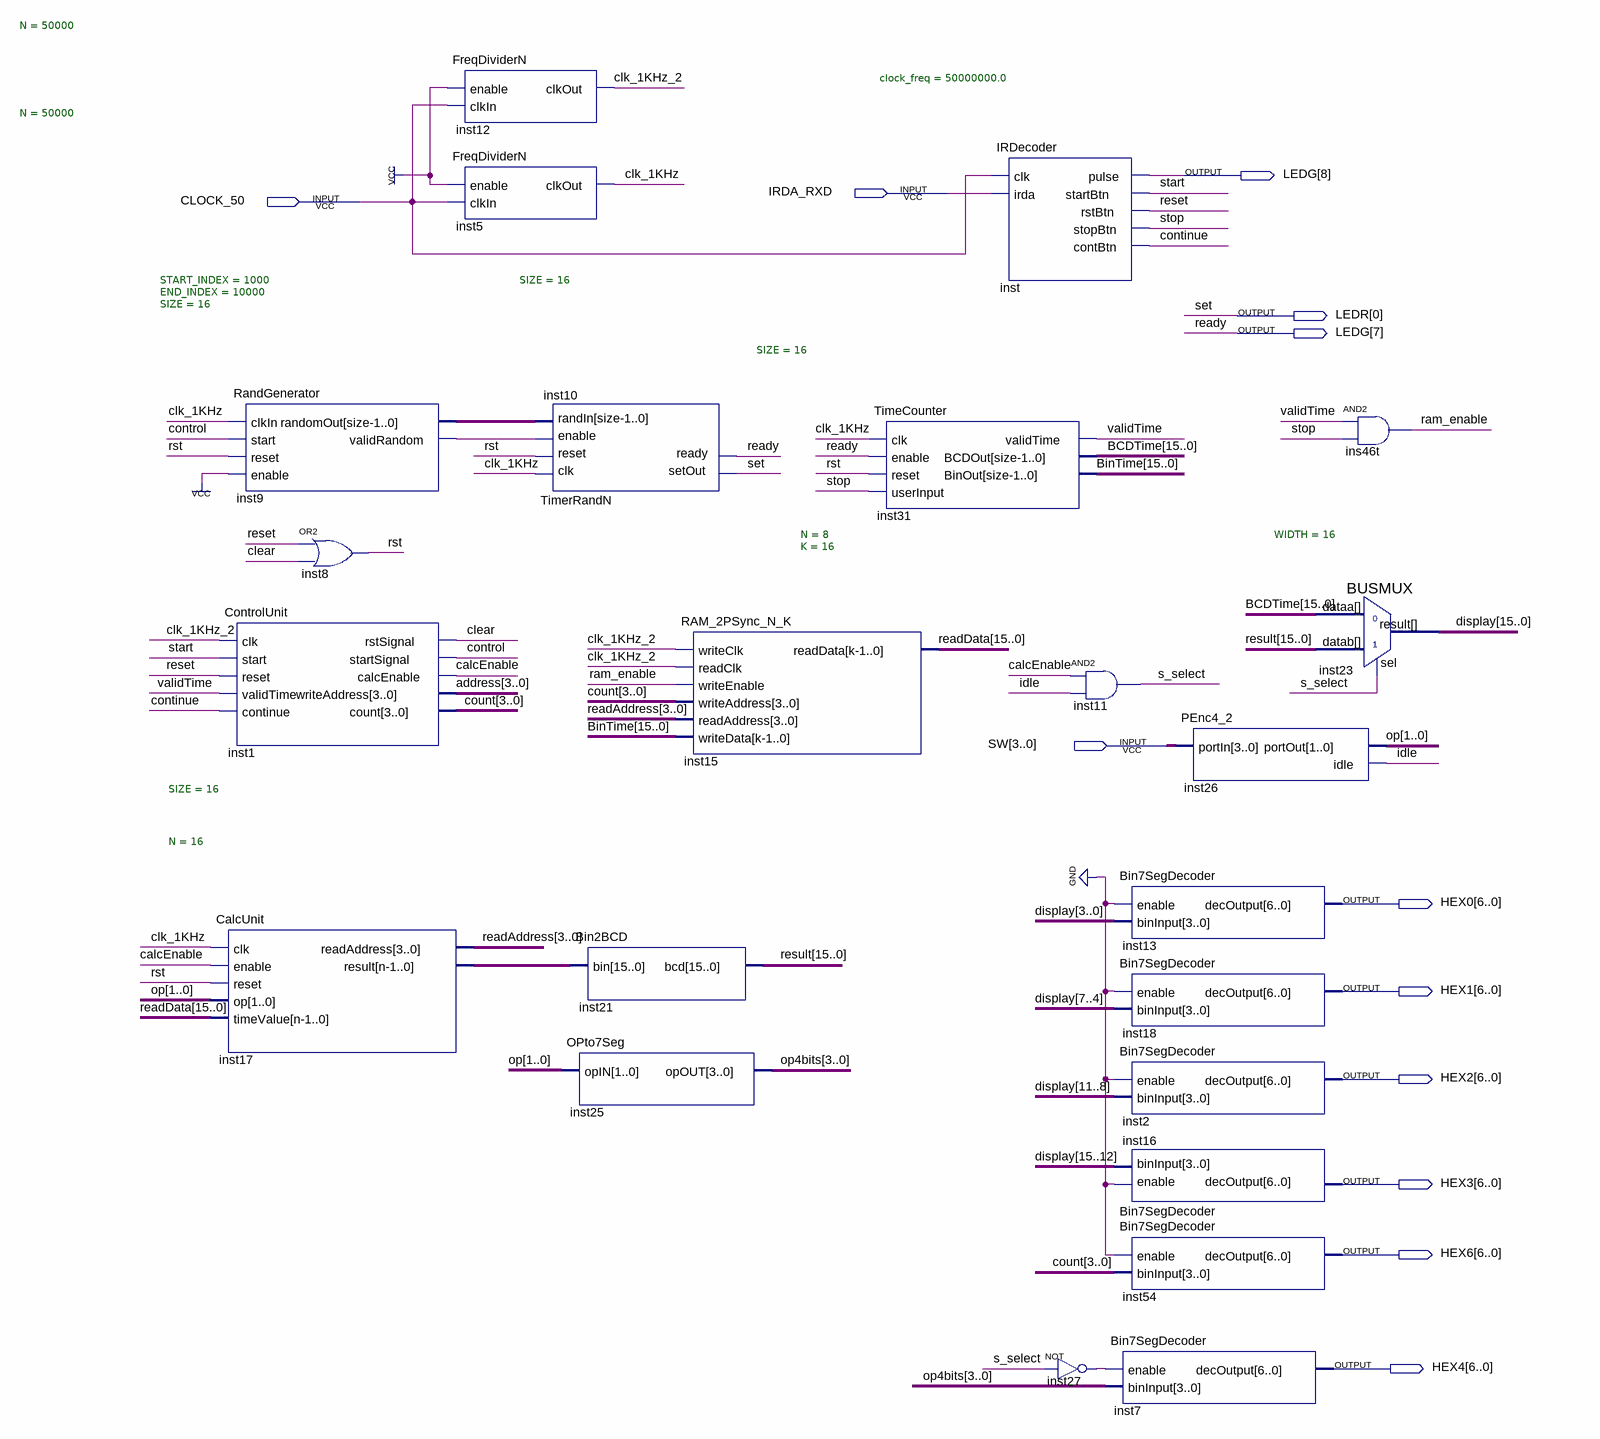
[diagram p0: schematic sheet]
// Quartus schematic ReactionTime_Demo.bdf as structural Verilog: 23 symbols, 12 pins
module ReactionTime_Demo (
  input  IRDA_RXD,
  input  CLOCK_50,
  input  [3:0] SW,
  output [8:7] LEDG,
  output [0:0] LEDR,
  output [6:0] HEX0,
  output [6:0] HEX1,
  output [6:0] HEX2,
  output [6:0] HEX3,
  output [6:0] HEX6,
  output [6:0] HEX4
);

  wire calcEnable, clear, clk_1KHz, clk_1KHz_2, \continue , control, idle, inst9_validrandom, inst27_out,
       ram_enable, reset, rst, s_select, start, stop, validTime;
  wire [1:0] op;
  wire [3:0] address, count, op4bits, readAddress;
  wire [15:0] BCDTime, BinTime, display, inst9_randomout, inst17_result, readData, result;

  RandGenerator #(.START_INDEX(1000), .END_INDEX(10000), .SIZE(16)) inst9 (
    .clkIn(clk_1KHz), .start(control), .reset(rst), .enable(1'b1), .randomOut(inst9_randomout),
    .validRandom(inst9_validrandom));
  ControlUnit #(.SIZE(16)) inst1 (
    .clk(clk_1KHz_2), .start(start), .reset(reset), .validTime(validTime), .\continue (\continue ),
    .rstSignal(clear), .startSignal(control), .calcEnable(calcEnable), .writeAddress(address), .count(count));
  CalcUnit #(.N(16)) inst17 (
    .clk(clk_1KHz), .enable(calcEnable), .reset(rst), .op(op), .timeValue(readData),
    .readAddress(readAddress), .result(inst17_result));
  or inst8 (rst, reset, clear);
  FreqDividerN #(.N(50000)) inst12 (.enable(1'b1), .clkIn(CLOCK_50), .clkOut(clk_1KHz_2));
  FreqDividerN #(.N(50000)) inst5 (.enable(1'b1), .clkIn(CLOCK_50), .clkOut(clk_1KHz));
  TimerRandN #(.SIZE(16)) inst10 (
    .clk(clk_1KHz), .reset(rst), .enable(inst9_validrandom), .randIn(inst9_randomout), .setOut(LEDR[0]),
    .ready(LEDG[7]));
  Bin2BCD inst21 (.bin(inst17_result), .bcd(result));
  OPto7Seg inst25 (.opIN(op), .opOUT(op4bits));
  RAM_2PSync_N_K #(.N(8), .K(16)) inst15 (
    .writeClk(clk_1KHz_2), .readClk(clk_1KHz_2), .writeEnable(ram_enable), .writeAddress(count),
    .readAddress(readAddress), .writeData(BinTime), .readData(readData));
  TimeCounter #(.SIZE(16)) inst31 (
    .clk(clk_1KHz), .enable(LEDG[7]), .reset(rst), .userInput(stop), .validTime(validTime), .BCDOut(BCDTime),
    .BinOut(BinTime));
  IRDecoder #(.clock_freq(50000000.0)) inst (
    .clk(CLOCK_50), .irda(IRDA_RXD), .pulse(LEDG[8]), .startBtn(start), .rstBtn(reset), .stopBtn(stop),
    .contBtn(\continue ));
  and inst11 (s_select, calcEnable, idle);
  not inst27 (inst27_out, s_select);
  Bin7SegDecoder inst13 (.enable(1'b0), .binInput(display[3:0]), .decOutput(HEX0));
  Bin7SegDecoder inst18 (.enable(1'b0), .binInput(display[7:4]), .decOutput(HEX1));
  Bin7SegDecoder inst2 (.enable(1'b0), .binInput(display[11:8]), .decOutput(HEX2));
  Bin7SegDecoder inst16 (.enable(1'b0), .binInput(display[15:12]), .decOutput(HEX3));
  Bin7SegDecoder inst54 (.enable(1'b0), .binInput(count), .decOutput(HEX6));
  Bin7SegDecoder inst7 (.enable(inst27_out), .binInput(op4bits), .decOutput(HEX4));
  PEnc4_2 inst26 (.portIn(SW), .portOut(op), .idle(idle));
  and ins46t (ram_enable, validTime, stop);
  BUSMUX #(.WIDTH(16)) inst23 (.datab(result), .sel(s_select), .dataa(BCDTime), .result(display));

  // Other names for the same wires on the sheet: ready = LEDG[7]; set = LEDR[0]
endmodule
